# Altium schematic sheet RS2-708_V010.SchDoc
size A4
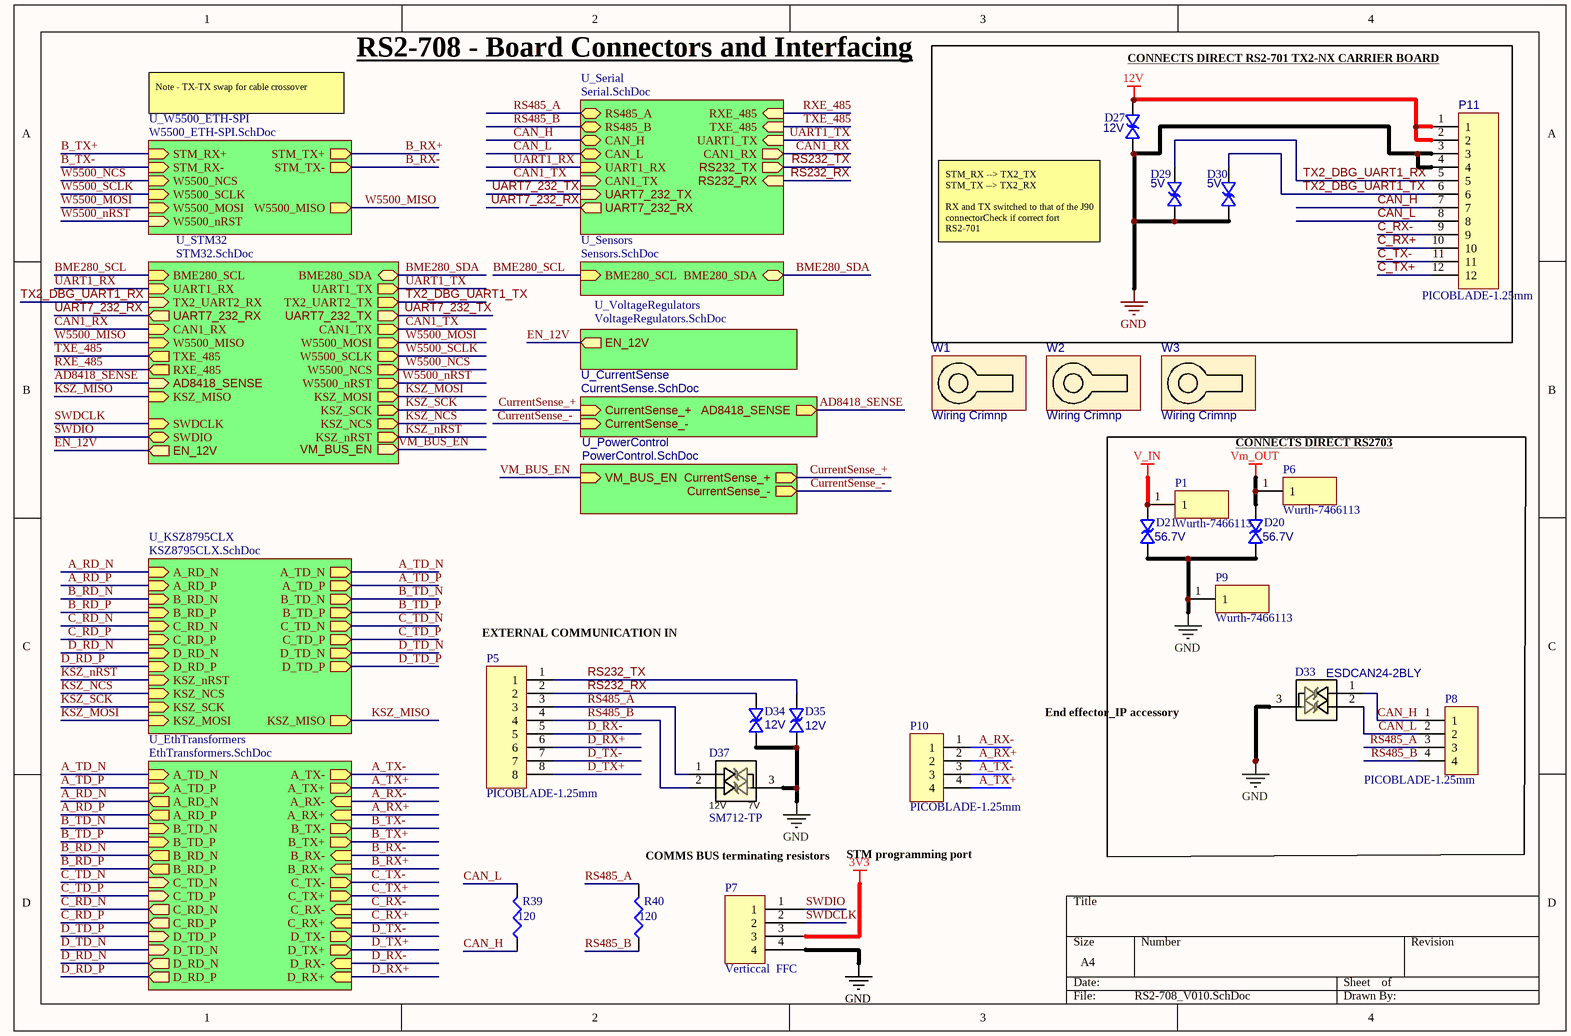
[diagram p0: RS2-708_V010.SchDoc]

## Parts
D20  Reverse Breakdown Voltage: 56.7V  [DO-214AB]  (hidden comment: TVS-Bidirectional)
D21  Reverse Breakdown Voltage: 56.7V  [DO-214AB]  (hidden comment: TVS-Bidirectional)
D27  Working Voltage: 12V  [SLP1006P2T]  (hidden comment: TVS-Bidirectional)
D29  Reverse Standoff Voltage: 5V  [SLP1006P2T]  (hidden comment: TVS-Bidirectional)
D30  Reverse Standoff Voltage: 5V  [SLP1006P2T]  (hidden comment: TVS-Bidirectional)
D33  Manufacturer Part Number 1: ESDCAN24-2BLY  [SOT23-BAT54]  (hidden comment: TVS- 3-pin)
D34  Working Voltage: 12V  [SLP1006P2T]  (hidden comment: TVS-Bidirectional)
D35  Working Voltage: 12V  [SLP1006P2T]  (hidden comment: TVS-Bidirectional)
D37  SM712-TP  [SOT23-BAT54]
P1  Wurth-7466113  [7466113_V2]
P5  PICOBLADE-1.25mm  [532617008]
P6  Wurth-7466113  [7466113_V2]
P7  Verticcal  FFC  [AFC11-S04ICC-00]
P8  PICOBLADE-1.25mm  [532617004]
P9  Wurth-7466113  [7466113_V2]
P10  PICOBLADE-1.25mm  [532617004]
P11  PICOBLADE-1.25mm  [532617012]
R39  value 120  [RES0805]  (hidden comment: Res)
R40  value 120  [RES0805]  (hidden comment: Res)
W1  Wiring Crimnp  [Power_M3_Eyelet_Up]
W2  Wiring Crimnp  [Power_M3_Eyelet_Up]
W3  Wiring Crimnp  [Power_M3_Eyelet_Up]

## Blocks framed on the sheet
CONNECTS DIRECT RS2-701 TX2-NX CARRIER BOARD: D27 D29 D30 P11
CONNECTS DIRECT RS2703: D20 D21 D33 P1 P6 P8 P9

## Sub-sheets
U_CurrentSense = CurrentSense.SchDoc: AD8418_SENSE (out), CurrentSense_+ (in), CurrentSense_- (in)
U_EthTransformers = EthTransformers.SchDoc: A_RD_N (out), A_RD_P (out), A_TD_N (in), A_TD_P (in), B_RD_N (out), B_RD_P (out), B_TD_N (in), B_TD_P (in), A_TX+ (out), A_TX- (out), A_RX+ (in), A_RX- (in), B_TX+ (out), B_TX- (out), B_RX+ (in), B_RX- (in), C_TX+ (out), C_TX- (out), C_RX+ (in), C_RX- (in), D_TX+ (out), D_TX- (out), D_RX+ (in), D_RX- (in), D_TD_N (in), C_RD_P (out), C_TD_N (in), C_RD_N (out), D_TD_P (in), D_RD_N (out), C_TD_P (in), D_RD_P (out)
U_KSZ8795CLX = KSZ8795CLX.SchDoc: A_RD_P (in), A_RD_N (in), A_TD_P (out), A_TD_N (out), B_RD_N (in), B_RD_P (in), B_TD_N (out), B_TD_P (out), C_RD_N (in), C_RD_P (in), C_TD_N (out), C_TD_P (out), D_RD_N (in), D_RD_P (in), D_TD_N (out), D_TD_P (out), KSZ_nRST (in), KSZ_NCS (in), KSZ_SCK (in), KSZ_MISO (out), KSZ_MOSI (in)
U_PowerControl = PowerControl.SchDoc: VM_BUS_EN (in), CurrentSense_+ (out), CurrentSense_- (out)
U_Sensors = Sensors.SchDoc: BME280_SCL (in), BME280_SDA (bidir)
U_Serial = Serial.SchDoc: RS485_A (bidir), RS485_B (bidir), CAN_H (bidir), CAN_L (bidir), UART1_RX (in), CAN1_TX (in), CAN1_RX (out), RXE_485 (in), UART1_TX (in), TXE_485 (in), RS232_RX (in), RS232_TX (out), UART7_232_TX (in), UART7_232_RX (out)
U_STM32 = STM32.SchDoc: BME280_SCL (in), UART1_TX (out), UART1_RX (in), W5500_MISO (in), W5500_MOSI (out), W5500_SCLK (out), SWDCLK (in), W5500_NCS (out), CAN1_TX (out), SWDIO (bidir), RXE_485 (out), CAN1_RX (in), TXE_485 (out), KSZ_NCS (out), KSZ_SCK (out), KSZ_MISO (in), KSZ_MOSI (out), W5500_nRST (out), TX2_UART2_TX (out), KSZ_nRST (out), TX2_UART2_RX (in), BME280_SDA (bidir), UART7_232_RX (out), UART7_232_TX (out), VM_BUS_EN (out), AD8418_SENSE (in), EN_12V (out)
U_VoltageRegulators = VoltageRegulators.SchDoc: EN_12V (out)
U_W5500_ETH-SPI = W5500_ETH-SPI.SchDoc: STM_TX+ (out), STM_TX- (out), STM_RX+ (in), STM_RX- (in), W5500_NCS (in), W5500_SCLK (in), W5500_MOSI (in), W5500_MISO (out), W5500_nRST (in)

## Nets
3V3: P7.3
12V: D27.2 P11.1 P11.2
GND: D20.1 D21.1 D27.1 D29.2 D30.2 D33.3 D34.1 D35.1 D37.3 P7.4 P9.1 P11.3 P11.4
V_IN: D21.2 P1.1
Vm_OUT: D20.2 P6.1
A_RD_N: sheet U_EthTransformers/A_RD_N, sheet U_KSZ8795CLX/A_RD_N
A_RD_P: sheet U_EthTransformers/A_RD_P, sheet U_KSZ8795CLX/A_RD_P
A_RX+: P10.2 ; sheet U_EthTransformers/A_RX+
A_RX-: P10.1 ; sheet U_EthTransformers/A_RX-
A_TD_N: sheet U_EthTransformers/A_TD_N, sheet U_KSZ8795CLX/A_TD_N
A_TD_P: sheet U_EthTransformers/A_TD_P, sheet U_KSZ8795CLX/A_TD_P
A_TX+: P10.4 ; sheet U_EthTransformers/A_TX+
A_TX-: P10.3 ; sheet U_EthTransformers/A_TX-
AD8418_SENSE: sheet U_STM32/AD8418_SENSE, sheet U_CurrentSense/AD8418_SENSE
B_RD_N: sheet U_EthTransformers/B_RD_N, sheet U_KSZ8795CLX/B_RD_N
B_RD_P: sheet U_EthTransformers/B_RD_P, sheet U_KSZ8795CLX/B_RD_P
B_RX+: sheet U_EthTransformers/B_RX+, sheet U_W5500_ETH-SPI/STM_TX+
B_RX-: sheet U_EthTransformers/B_RX-, sheet U_W5500_ETH-SPI/STM_TX-
B_TD_N: sheet U_EthTransformers/B_TD_N, sheet U_KSZ8795CLX/B_TD_N
B_TD_P: sheet U_EthTransformers/B_TD_P, sheet U_KSZ8795CLX/B_TD_P
B_TX+: sheet U_EthTransformers/B_TX+, sheet U_W5500_ETH-SPI/STM_RX+
B_TX-: sheet U_EthTransformers/B_TX-, sheet U_W5500_ETH-SPI/STM_RX-
BME280_SCL: sheet U_Sensors/BME280_SCL, sheet U_STM32/BME280_SCL
BME280_SDA: sheet U_Sensors/BME280_SDA, sheet U_STM32/BME280_SDA
C_RD_N: sheet U_EthTransformers/C_RD_N, sheet U_KSZ8795CLX/C_RD_N
C_RD_P: sheet U_EthTransformers/C_RD_P, sheet U_KSZ8795CLX/C_RD_P
C_RX+: P11.10 ; sheet U_EthTransformers/C_RX+
C_RX-: P11.9 ; sheet U_EthTransformers/C_RX-
C_TD_N: sheet U_EthTransformers/C_TD_N, sheet U_KSZ8795CLX/C_TD_N
C_TD_P: sheet U_EthTransformers/C_TD_P, sheet U_KSZ8795CLX/C_TD_P
C_TX+: P11.12 ; sheet U_EthTransformers/C_TX+
C_TX-: P11.11 ; sheet U_EthTransformers/C_TX-
CAN1_RX: sheet U_Serial/CAN1_RX, sheet U_STM32/CAN1_RX
CAN1_TX: sheet U_Serial/CAN1_TX, sheet U_STM32/CAN1_TX
CAN_H: D33.1 P8.1 P11.7 R39.1 ; sheet U_Serial/CAN_H
CAN_L: D33.2 P8.2 P11.8 R39.2 ; sheet U_Serial/CAN_L
CurrentSense_+: sheet U_CurrentSense/CurrentSense_+, sheet U_PowerControl/CurrentSense_+
CurrentSense_-: sheet U_CurrentSense/CurrentSense_-, sheet U_PowerControl/CurrentSense_-
D_RD_N: sheet U_EthTransformers/D_RD_N, sheet U_KSZ8795CLX/D_RD_N
D_RD_P: sheet U_EthTransformers/D_RD_P, sheet U_KSZ8795CLX/D_RD_P
D_RX+: P5.6 ; sheet U_EthTransformers/D_RX+
D_RX-: P5.5 ; sheet U_EthTransformers/D_RX-
D_TD_N: sheet U_EthTransformers/D_TD_N, sheet U_KSZ8795CLX/D_TD_N
D_TD_P: sheet U_EthTransformers/D_TD_P, sheet U_KSZ8795CLX/D_TD_P
D_TX+: P5.8 ; sheet U_EthTransformers/D_TX+
D_TX-: P5.7 ; sheet U_EthTransformers/D_TX-
EN_12V: sheet U_STM32/EN_12V, sheet U_VoltageRegulators/EN_12V
KSZ_MISO: sheet U_KSZ8795CLX/KSZ_MISO, sheet U_STM32/KSZ_MISO
KSZ_MOSI: sheet U_KSZ8795CLX/KSZ_MOSI, sheet U_STM32/KSZ_MOSI
KSZ_NCS: sheet U_KSZ8795CLX/KSZ_NCS, sheet U_STM32/KSZ_NCS
KSZ_nRST: sheet U_KSZ8795CLX/KSZ_nRST, sheet U_STM32/KSZ_nRST
KSZ_SCK: sheet U_KSZ8795CLX/KSZ_SCK, sheet U_STM32/KSZ_SCK
RS232_RX: D34.2 P5.2 ; sheet U_Serial/RS232_RX
RS232_TX: D35.2 P5.1 ; sheet U_Serial/RS232_TX
RS485_A: D37.1 P5.3 P8.3 R40.2 ; sheet U_Serial/RS485_A
RS485_B: D37.2 P5.4 P8.4 R40.1 ; sheet U_Serial/RS485_B
RXE_485: sheet U_Serial/RXE_485, sheet U_STM32/RXE_485
SWDCLK: P7.2 ; sheet U_STM32/SWDCLK
SWDIO: P7.1 ; sheet U_STM32/SWDIO
TX2_DBG_UART1_RX: D29.1 P11.5 ; sheet U_STM32/TX2_UART2_RX
TX2_DBG_UART1_TX: D30.1 P11.6 ; sheet U_STM32/TX2_UART2_TX
TXE_485: sheet U_Serial/TXE_485, sheet U_STM32/TXE_485
UART1_RX: sheet U_Serial/UART1_RX, sheet U_STM32/UART1_RX
UART1_TX: sheet U_Serial/UART1_TX, sheet U_STM32/UART1_TX
UART7_232_RX: sheet U_Serial/UART7_232_RX, sheet U_STM32/UART7_232_RX
UART7_232_TX: sheet U_Serial/UART7_232_TX, sheet U_STM32/UART7_232_TX
VM_BUS_EN: sheet U_STM32/VM_BUS_EN, sheet U_PowerControl/VM_BUS_EN
W5500_MISO: sheet U_STM32/W5500_MISO, sheet U_W5500_ETH-SPI/W5500_MISO
W5500_MOSI: sheet U_STM32/W5500_MOSI, sheet U_W5500_ETH-SPI/W5500_MOSI
W5500_NCS: sheet U_STM32/W5500_NCS, sheet U_W5500_ETH-SPI/W5500_NCS
W5500_nRST: sheet U_STM32/W5500_nRST, sheet U_W5500_ETH-SPI/W5500_nRST
W5500_SCLK: sheet U_STM32/W5500_SCLK, sheet U_W5500_ETH-SPI/W5500_SCLK

## Notes on the sheet
- Note - TX-TX swap for cable crossover
- RS2-708 - Board Connectors and Interfacing
- (near D27) STM_RX --> TX2_TX
  STM_TX --> TX2_RX
  RX and TX switched to that of the J90 connectorCheck if correct fort RS2-701
- (near P5) EXTERNAL COMMUNICATION IN
- (near P10) End effector_IP accessory
- COMMS BUS terminating resistors
- STM programming port
- (in symbol SM712-TP) 7V

## Library data of the parts
D20 D21 = TVS-Bidirectional: TVS DIODE, 400W, 51V, DO-214AC, FULL REEL; Product Range:SMAJ Series; TVS Polarity:Bidirectional; Reverse Stand-Off Voltage Vrwm:51V; Diode Case Style:DO-214AC; No. of Pins:2Pins; Breakdown Voltage Min:56.7V; Packaging:Tape & Reel ;RoHS Compliant: Yes; Manufacturer 1: Littelfuse; Manufacturer Part Number 1: SMAJ51CA; Clamping Voltage: 82.4V; Power Line Protection: No; Number of Channels: 1; Max Breakdown Voltage: 62.7V; Peak Pulse Current: 4.9A; Test Current: 1mA; Max Power Dissipation: 3.3W; Leakage Current: 1uA; Supplier 1: Digi-Key; Supplier Part Number 1: SMAJ51CALFCT-ND; RoHS: Yes; Category: TVS Diodes; Stock 1: 36618; Pricing 1: 1=0,45000, 10=0,33600, 100=0,15950, 500=0,14136, 1000=0,11000, 2000=0,10065 (USD); Mount: Surface Mount; Number of Pins: 2; Min Operating Temperature: -55°C; Max Operating Temperature: 150°C; Peak Pulse Power: 400W; Breakdown Voltage: 56.7V; Polarity: Bidirectional; Termination: SMD/SMT; Resistor Type: Zener; Number of Elements: 1; Power Dissipation: 400W; Voltage Rating (DC): 51V; Package Quantity: 5000; Direction: Bidirectional; Packaging: Tape and Reel; Operating Supply Voltage: 51V; Max Surge Current: 4.9A; Number of Bidirectional Channels: 1; Reverse Standoff Voltage: 51V; Min Breakdown Voltage: 56.7V; Length: 5.28mm; Width: 2.79mm; Height: 2.29mm; Lead Free: Lead Free; REACH SVHC: No SVHC; ComponentLink1URL: https://datasheet.ciiva.com/331/littelfuse-tvs-diode-smaj-datasheet-pdf-331040.pdf?src-supplier=Digi-Key; ComponentLink1Description: https://datasheet.ciiva.com/331/littelfuse-tvs-diode-smaj-datasheet-pdf-331040.pdf?src-supplier=Digi-Key; ComponentLink2URL: https://datasheet.ciiva.com/331/littelfuse-tvs-diode-smaj-datasheet-pdf-331041.pdf?src-supplier=Digi-Key; ComponentLink2Description: https://datasheet.ciiva.com/331/littelfuse-tvs-diode-smaj-datasheet-pdf-331041.pdf?src-supplier=Digi-Key; ComponentLink3URL: https://datasheet.ciiva.com/16215/littelfuse-tvs-diode-smaj-16215707.pdf?src-supplier=Future+Electronics; ComponentLink3Description: https://datasheet.ciiva.com/16215/littelfuse-tvs-diode-smaj-16215707.pdf?src-supplier=Future+Electronics; ComponentLink4URL: https://datasheet.ciiva.com/331/littelfuse-tvs-diode-smaj-datasheet-pdf-331039.pdf?src-supplier=Digi-Key; ComponentLink4Description: https://datasheet.ciiva.com/331/littelfuse-tvs-diode-smaj-datasheet-pdf-331039.pdf?src-supplier=Digi-Key
D27 D34 D35 = TVS-Bidirectional: TVS DIODE 12V 27V SLP1006P2T; Manufacturer 1: Semtech; Manufacturer Part Number 1: UCLAMP1211T.TCT; Element Configuration: Single; Peak Pulse Current: 1A; Number of Bidirectional Channels: 1; Min Breakdown Voltage: 13.3V; Power Line Protection: No; Leakage Current: 50nA; Supplier 1: Digi-Key; Supplier Part Number 1: UCLAMP1211T.TCTCT-ND; RoHS: Yes; Category: TVS Diodes; Stock 1: 75056; Pricing 1: 1=0,68000, 10=0,59400, 100=0,40500, 500=0,33840, 1000=0,28800 (USD); Mount: Surface Mount; Case/Package: 0402; Number of Pins: 2; Case Code (Imperial): 0402; Case Code (Metric): 1006; Min Operating Temperature: -55°C; Max Operating Temperature: 125°C; Direction: Bidirectional; Clamping Voltage: 27V; Package Quantity: 3000; Packaging: Tape and Reel; Resistor Type: Zener; Reverse Standoff Voltage: 12V; Length: 1mm; Depth: 0.6mm; Radiation Hardening: No; ComponentLink1URL: https://datasheet.ciiva.com/29587/uclamp1211t-29587782.pdf?src-supplier=Digi-Key; ComponentLink1Description: https://datasheet.ciiva.com/29587/uclamp1211t-29587782.pdf?src-supplier=Digi-Key; ComponentLink2URL: https://datasheet.ciiva.com/45262/uclamp1211t-45262805.pdf?src-supplier=Digi-Key; ComponentLink2Description: https://datasheet.ciiva.com/45262/uclamp1211t-45262805.pdf?src-supplier=Digi-Key; ComponentLink3URL: https://datasheet.ciiva.com/11195/uclamp1211t-11195113.pdf?src-supplier=Avnet; ComponentLink3Description: https://datasheet.ciiva.com/11195/uclamp1211t-11195113.pdf?src-supplier=Avnet
D29 D30 = TVS-Bidirectional: TVS DIODE 5V 20V SLP1006P2T; Manufacturer 1: Semtech; Manufacturer Part Number 1: RCLAMP0531TQTCT; Peak Pulse Current: 4A; Element Configuration: Single; Number of Bidirectional Channels: 1; Min Breakdown Voltage: 6V; Peak Pulse Power: 80W; Power Line Protection: No; Leakage Current: 100nA; Supplier 1: Digi-Key; Supplier Part Number 1: RCLAMP0531TQTCTCT-ND; RoHS: Yes; Category: TVS Diodes; Stock 1: 9000; Pricing 1: 1=1,09000, 10=0,97400, 100=0,69300, 500=0,58740, 1000=0,47850 (USD); Mount: Surface Mount; Case/Package: 0402; Number of Pins: 2; Case Code (Imperial): 0402; Case Code (Metric): 1006; Min Operating Temperature: -40°C; Max Operating Temperature: 125°C; Direction: Bidirectional; Packaging: Tape and Reel; Package Quantity: 3000; Resistor Type: Zener; Clamping Voltage: 20V; Working Voltage: 5V; Length: 1mm; Depth: 0.6mm; Radiation Hardening: No; Lead Free: Lead Free; ComponentLink1URL: https://datasheet.ciiva.com/26946/getdatasheetpartid-791156-26946873.pdf?src-supplier=Verical; ComponentLink1Description: https://datasheet.ciiva.com/26946/getdatasheetpartid-791156-26946873.pdf?src-supplier=Verical; ComponentLink2URL: https://datasheet.ciiva.com/29574/rclamp0531tq-29574060.pdf?src-supplier=Digi-Key; ComponentLink2Description: https://datasheet.ciiva.com/29574/rclamp0531tq-29574060.pdf?src-supplier=Digi-Key
D33 = TVS- 3-pin: ESD Suppressor TVS 24V Automotive 3-Pin SOT-23 T/R; Manufacturer 1: STMicroelectronics; Direction: Bidirectional; Capacitance: 30pF; Number of Channels: 2; Breakdown Voltage: 27V; Clamping Voltage: 43V; Max Power Dissipation: 230W; Min Breakdown Voltage: 26.2V; Power Line Protection: No; Leakage Current: 100nA; ESD Protection: Yes; Element Configuration: Dual; Peak Pulse Current: 5.5A; Diode Type: ZENER; Supplier 1: Digi-Key; Supplier Part Number 1: 497-13262-1-ND; RoHS: Yes; Category: TVS Diodes; Stock 1: 51547; Pricing 1: 1=0,40000, 10=0,31000, 100=0,18570, 500=0,17198, 1000=0,12980 (USD); Mount: Surface Mount; Case/Package: SOT-23; Number of Pins: 3; Min Operating Temperature: -40°C; Max Operating Temperature: 150°C; Packaging: Tape and Reel; Package Quantity: 1; Polarity: Bidirectional; Termination: SMD/SMT; Working Voltage: 24V; Number of Bidirectional Channels: 2; Reverse Standoff Voltage: 24V; Peak Pulse Power: 230W; Max Reverse Leakage Current: 100nA; Resistor Type: Zener; Series: Automotive, AEC-Q101, ESDCAY, TRANSIL™; Length: 2.9mm; Width: 1.75mm; Height: 1.4mm; Depth: 1.3mm; Radiation Hardening: No; REACH SVHC: No SVHC; Lead Free: Lead Free; RoHS Compliant: Yes; ComponentLink1URL: https://datasheet.ciiva.com/22685/1786030-22685811.pdf?src-supplier=Element14; ComponentLink1Description: https://datasheet.ciiva.com/22685/1786030-22685811.pdf?src-supplier=Element14; ComponentLink2URL: https://datasheet.ciiva.com/26935/getdatasheetpartid-779627-26935935.pdf?src-supplier=Verical; ComponentLink2Description: https://datasheet.ciiva.com/26935/getdatasheetpartid-779627-26935935.pdf?src-supplier=Verical; ComponentLink3URL: https://datasheet.ciiva.com/23803/dm00037599-23803632.pdf?src-supplier=Newark; ComponentLink3Description: https://datasheet.ciiva.com/23803/dm00037599-23803632.pdf?src-supplier=Newark; ComponentLink4URL: https://datasheet.ciiva.com/12070/dm00037599-100424-12070821.pdf?src-supplier=Mouser; ComponentLink4Description: https://datasheet.ciiva.com/12070/dm00037599-100424-12070821.pdf?src-supplier=Mouser; ComponentLink5URL: https://datasheet.ciiva.com/6574/dm00037599-6574397.pdf?src-supplier=Digi-Key; ComponentLink5Description: https://datasheet.ciiva.com/6574/dm00037599-6574397.pdf?src-supplier=Digi-Key; ComponentLink6URL: https://datasheet.ciiva.com/6574/dm00037599-6574398.pdf?src-supplier=Digi-Key; ComponentLink6Description: https://datasheet.ciiva.com/6574/dm00037599-6574398.pdf?src-supplier=Digi-Key; ComponentLink7URL: https://datasheet.ciiva.com/16581/dm00037599-16581999.pdf?src-supplier=Avnet+Europe; ComponentLink7Description: https://datasheet.ciiva.com/16581/dm00037599-16581999.pdf?src-supplier=Avnet+Europe; ComponentLink8URL: https://datasheet.ciiva.com/41443/001183991-da-01-en-tvs-diode-24-esdcan24-2bly-sot-23-3l-stm-41443402.pdf?src-supplier=Conrad; ComponentLink8Description: https://datasheet.ciiva.com/41443/001183991-da-01-en-tvs-diode-24-esdcan24-2bly-sot-23-3l-stm-41443402.pdf?src-supplier=Conrad
D37 = SM712-TP: TVS DIODE 12V 21V SOT23; Manufacturer 1: MCC; Peak Pulse Current: 5A; Min Breakdown Voltage: 13.3V; Peak Pulse Power: 400W; Power Line Protection: No; Element Configuration: Dual; Direction: Bidirectional; Capacitance: 45pF; Leakage Current: 1uA; Number of Bidirectional Channels: 2; ComponentLink1URL: https://datasheet.ciiva.com/16480/rclamp0582b-16480625.pdf?src-supplier=Future+Electronics; ComponentLink1Description: https://datasheet.ciiva.com/16480/rclamp0582b-16480625.pdf?src-supplier=Future+Electronics; ComponentLink2URL: https://datasheet.ciiva.com/29588/rclamp0582bq-29588763.pdf?src-supplier=Digi-Key; ComponentLink2Description: https://datasheet.ciiva.com/29588/rclamp0582bq-29588763.pdf?src-supplier=Digi-Key; ComponentLink3URL: https://datasheet.ciiva.com/29588/rclamp0582bq-29588764.pdf?src-supplier=Digi-Key; ComponentLink3Description: https://datasheet.ciiva.com/29588/rclamp0582bq-29588764.pdf?src-supplier=Digi-Key; ComponentLink4URL: https://datasheet.ciiva.com/29588/rclamp0582bq-29588765.pdf?src-supplier=Digi-Key; ComponentLink4Description: https://datasheet.ciiva.com/29588/rclamp0582bq-29588765.pdf?src-supplier=Digi-Key; Supplier 1: Digi-Key; Manufacturer Part Number 1: SM712-TP; RoHS: Yes; Category: TVS Diodes; Stock 1: 53074; Pricing 1: 1=0,99000, 10=0,88500, 100=0,63000, 500=0,53400, 1000=0,43500 (USD); Mount: Surface Mount; Case/Package: SOT-23; Number of Pins: 3; Min Operating Temperature: -55°C; Max Operating Temperature: 150°C; Resistor Type: Zener; Package Quantity: 1; Packaging: Tape and Reel; Reverse Standoff Voltage: 12V; Clamping Voltage: 21V; Breakdown Voltage: 13.3V; Max Power Dissipation: 400W; Termination: SMD/SMT; Working Voltage: 12V; Current Rating: 1uA; Operating Supply Voltage: 12V; Number of Channels: 2; Length: 3.04mm; Depth: 1.4mm; Radiation Hardening: No; Lead Free: Lead Free; ComponentLink5URL: https://datasheet.ciiva.com/342/sm712sot-23-342378.pdf?src-supplier=Digi-Key; ComponentLink5Description: https://datasheet.ciiva.com/342/sm712sot-23-342378.pdf?src-supplier=Digi-Key; ComponentLink6URL: https://datasheet.ciiva.com/4479/sm712sot-23-52175-4479615.pdf?src-supplier=Mouser; ComponentLink6Description: https://datasheet.ciiva.com/4479/sm712sot-23-52175-4479615.pdf?src-supplier=Mouser; ComponentLink7URL: https://datasheet.ciiva.com/342/sm712sot-23-342379.pdf?src-supplier=Digi-Key; ComponentLink7Description: https://datasheet.ciiva.com/342/sm712sot-23-342379.pdf?src-supplier=Digi-Key; ComponentLink8URL: https://datasheet.ciiva.com/17443/sm712sot-23-17443003.pdf?src-supplier=Future+Electronics; ComponentLink8Description: https://datasheet.ciiva.com/17443/sm712sot-23-17443003.pdf?src-supplier=Future+Electronics; ComponentLink9URL: https://datasheet.ciiva.com/342/sm712sot-23-342380.pdf?src-supplier=Digi-Key; ComponentLink9Description: https://datasheet.ciiva.com/342/sm712sot-23-342380.pdf?src-supplier=Digi-Key; Supplier Part Number 1: SM712-TPMSCT-ND
P1 P6 P9 = 7466113: POWER ELEMENT SHANK; Manufacturer 1: Wurth Electronics; Current Rating: 50A; Number of Contacts: 1; Thread Size: M3; Supplier 1: Digi-Key; Manufacturer Part Number 1: 7466113; RoHS: Yes; Category: Terminals; Stock 1: 680; Pricing 1: 1=2,48000, 10=2,35200, 50=2,12800, 100=1,90400, 500=1,72500 (USD); Mount: Surface Mount; Number of Pins: 1; Contact Material: Brass; Contact Plating: Tin; Package Quantity: 100; Termination: Solder; Length: 7mm; REACH SVHC: Unknown; ComponentLink1URL: https://datasheet.ciiva.com/29669/7466113-29669842.pdf?src-supplier=Digi-Key; ComponentLink1Description: https://datasheet.ciiva.com/29669/7466113-29669842.pdf?src-supplier=Digi-Key; Supplier Part Number 1: 732-5246-ND
P5 = 532617008: 8POS Picoblade 1.25mm; Manufacturer: Molex; Manufacturer Part Number: 0532617008; Supplier 1: Digi-Key; Stock 1: 5950
P7 = AFC11-S04ICC-00: 4 pin FFC connector,0.5mm pitch, 0.5A; Component Type: 4 Position FPC Connector Contacts, Top and Bottom 0.020" (0.50mm) Surface Mount, Vertical Angle; Manufacturer Part Number: AFC11-S04ICC-00
P8 P10 = 0532617004: 4POS Picoblade 1.25mm; Manufacturer: Molex; Supplier 1: Digi-Key; Manufacturer Part Number: 0532617004; Stock 1: 5685; Supplier Part Number 1: WM25390CT-ND
P11 = 532611271: Conn.;  Rect/PCB;  Header;  W-to-B;  1.25mmPitch;  12 Cir.; SMT;  Rt. Angle;  PicoBlade; Manufacturer 1: Molex; Manufacturer Part Number 1: 53261-1271; Body Plating: Tin; Contact Resistance: 20mR; Current Rating: 1A; Voltage Rating: 125V; Number of Positions: 12; Insulation Resistance: 100MR; Gender: Male; Pitch: 1.25mm; Glow Wire Compliant: Non-compliant; Supplier 1: Digi-Key; RoHS: Yes; Category: Headers and Wire Housings; Stock 1: 3806; Pricing 1: 1=1,08000, 10=0,89000, 100=0,74200 (USD); Mount: Surface Mount; Contact Plating: Tin; Contact Material: Bronze,Tin,Brass; Color: Natural; Housing Material: Nylon; Housing Color: Natural; Min Operating Temperature: -40°C; Max Operating Temperature: 85°C; Number of Rows: 1; Package Quantity: 1000; Packaging: Tape and Reel; Voltage Rating (AC): 125V; Termination: Solder; Number of Contacts: 12; Working Voltage: 125V; Orientation: Right Angle; Voltage Rating (DC): 125V; Number of Circuits: 12; Series: PicoBlade; Contact Type: Blade Pin; Lead Pitch: 1.25mm; Depth: 5.2mm; Radiation Hardening: No; RoHS Compliant: Yes; REACH SVHC: Unknown; Lead Free: Lead Free; ComponentLink1URL: https://datasheet.ciiva.com/22704/1841148-22704823.pdf?src-supplier=Element14; ComponentLink1Description: https://datasheet.ciiva.com/22704/1841148-22704823.pdf?src-supplier=Element14; ComponentLink2URL: https://datasheet.ciiva.com/16657/0532611271-pcb-headers-16657841.pdf?src-supplier=Avnet+Europe; ComponentLink2Description: https://datasheet.ciiva.com/16657/0532611271-pcb-headers-16657841.pdf?src-supplier=Avnet+Europe; ComponentLink3URL: https://datasheet.ciiva.com/5156/0532611271-pcb-headers-256968-5156358.pdf?src-supplier=Mouser; ComponentLink3Description: https://datasheet.ciiva.com/5156/0532611271-pcb-headers-256968-5156358.pdf?src-supplier=Mouser; ComponentLink4URL: https://datasheet.ciiva.com/11749/0900766b8078fc82-11749268.pdf?src-supplier=RSComponents; ComponentLink4Description: https://datasheet.ciiva.com/11749/0900766b8078fc82-11749268.pdf?src-supplier=RSComponents; ComponentLink5URL: https://datasheet.ciiva.com/7814/1739297-7814874.pdf?src-supplier=Element14; ComponentLink5Description: https://datasheet.ciiva.com/7814/1739297-7814874.pdf?src-supplier=Element14; ComponentLink6URL: https://datasheet.ciiva.com/14488/1768013-14488444.pdf?src-supplier=Farnell; ComponentLink6Description: https://datasheet.ciiva.com/14488/1768013-14488444.pdf?src-supplier=Farnell; ComponentLink7URL: https://datasheet.ciiva.com/10083/0532611271-pcb-headers-10083068.pdf?src-supplier=Avnet; ComponentLink7Description: https://datasheet.ciiva.com/10083/0532611271-pcb-headers-10083068.pdf?src-supplier=Avnet; Supplier Part Number 1: WM7630CT-ND
R39 R40 = Resistor: Component Type: Resistor
W1-W3 = Wiring_CrimpConnector: Wiring Crimp Connector